# EAGLE schematic LCM Dimmer (EAGLE 6.5.0)
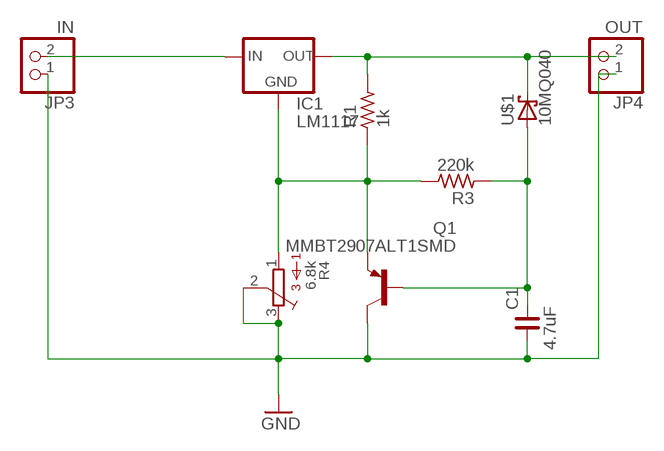
[diagram p0: schematic, sheet 1]

## Parts
C1  4.7uF  C_1206  [C1206]
IC1  LM1117  [SOT223]
JP3  IN  PINHD-1X02_2.54-S  [1X02-S]
JP4  OUT  PINHD-1X02_2.54-S  [1X02-S]
Q1  MMBT2907ALT1SMD  [SOT23-BEC]
R1  1k  R_1206  [R1206]
R3  220k  R_1206  [R1206]
R4  6.8k  3362P  [3362P]
U$1  10MQ040  [SMA]

## Nets
GND: C1.1 JP3.1 JP4.1 Q1.C R4.2 R4.3
N$1: IC1.1(GND) Q1.E R1.1 R3.2 R4.1
N$2: IC1.2(OUT) JP4.2 R1.2 U$1.C
N$3: C1.2 Q1.B R3.1 U$1.A
N$4: IC1.3(IN) JP3.2

## Library data of the parts
C1 = rc-master-smd:C_: NON-POLARIZED CAP
IC1 = v-reg-3:LM1117
JP3 JP4 = pinhead-2:PINHD-1X02: PIN HEADER
Q1 = transistor-pnp:MMBT2907*: PNP Transistror
R1 R3 = rc-master-smd:R_: RESISTOR
R4 = bourns:3362: 3362 Series 1/4" Square Trimmer
U$1 = my-library:10MQ040: SCHOTTKY